# Altium schematic sheet analog.SchDoc
size A4; DocumentNumber: 4; SheetNumber: 2
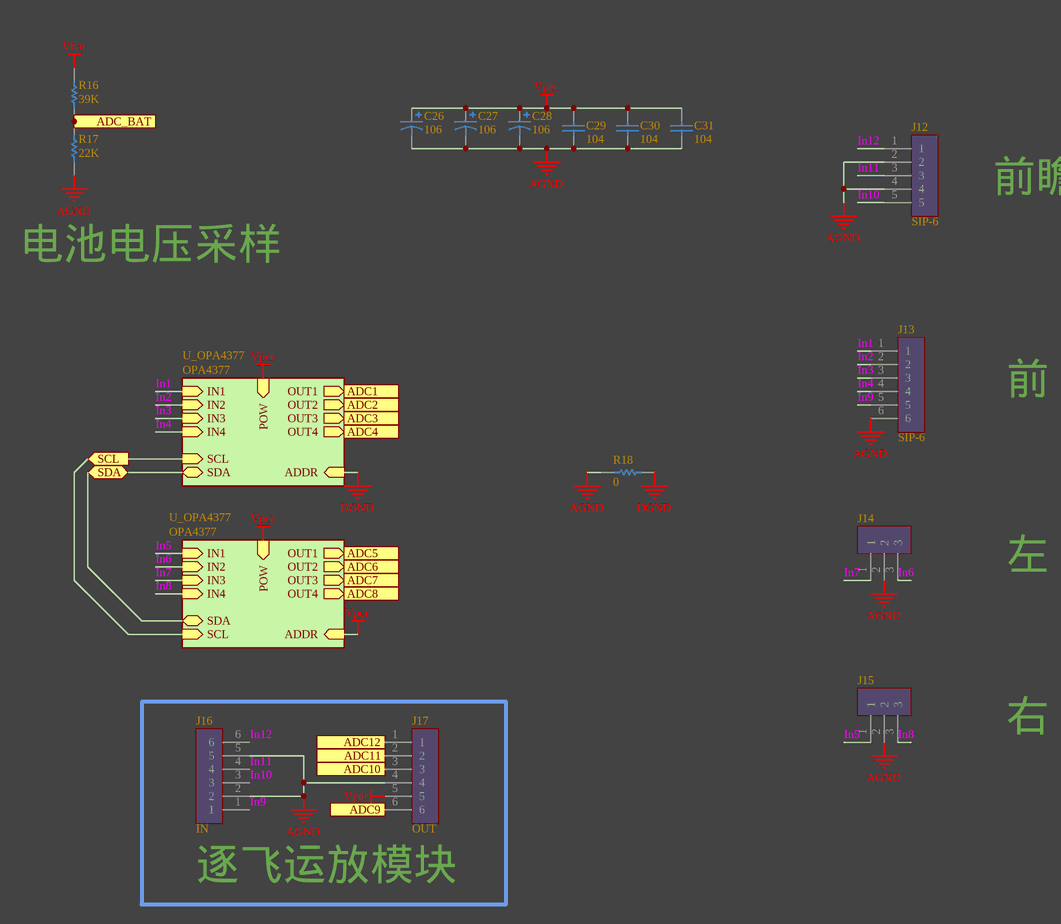
[diagram p0: analog.SchDoc]

## Parts
C26  106  [3216-ce]
C27  106  [3216-ce]
C28  106  [3216-ce]
C29  104  [C0402]
C30  104  [C0402]
C31  104  [C0402]
J12  SIP-6  [2.54排针1X5]
J13  SIP-6  [2.54简易牛角座6P]
J14  SIP-3  [XH2.54-3SMD]  (value not drawn)
J15  SIP-3  [XH2.54-3SMD]  (value not drawn)
J16  IN  [2.54排针1X6]
J17  OUT  [2.54排针1X6]
R16  39K  [R0402]
R17  22K  [R0402]
R18  0  [R0603]

## Blocks framed on the sheet
逐飞运放模块: J16 J17

## Sub-sheets
U_OPA4377 = OPA4377: IN1 (in), IN2 (in), IN3 (in), IN4 (in), OUT1 (out), OUT2 (out), OUT3 (out), OUT4 (out), POW (in), ADDR (in), SDA (bidir), SCL (in)
U_OPA4377 = OPA4377: IN1 (in), IN2 (in), IN3 (in), IN4 (in), OUT1 (out), OUT2 (out), OUT3 (out), OUT4 (out), POW (in), ADDR (in), SDA (bidir), SCL (in)

## Ports
ADC1 (out), ADC2 (out), ADC3 (out), ADC4 (out), ADC5 (out), ADC6 (out), ADC7 (out), ADC8 (out), ADC9 (out), ADC10 (out), ADC11 (out), ADC12 (out), ADC_BAT (out), SCL (in), SDA (bidir)

## Nets
AGND: C26.2 C27.2 C28.2 C29.1 C30.1 C31.1 J12.2 J12.4 J13.6 J14.2 J15.2 J16.2 J16.5 J17.4 R17.1 R18.2
DGND: R18.1 ; sheet U_OPA4377/ADDR
Vbat: R16.2
Vper: C26.1 C27.1 C28.1 C29.2 C30.2 C31.2 J17.5 ; sheet U_OPA4377/POW, sheet U_OPA4377/POW, sheet U_OPA4377/ADDR
ADC1: port ADC1, sheet U_OPA4377/OUT1
ADC2: port ADC2, sheet U_OPA4377/OUT2
ADC3: port ADC3, sheet U_OPA4377/OUT3
ADC4: port ADC4, sheet U_OPA4377/OUT4
ADC5: port ADC5, sheet U_OPA4377/OUT1
ADC6: port ADC6, sheet U_OPA4377/OUT2
ADC7: port ADC7, sheet U_OPA4377/OUT3
ADC8: port ADC8, sheet U_OPA4377/OUT4
ADC9: J17.6 ; port ADC9
ADC10: J17.3 ; port ADC10
ADC11: J17.2 ; port ADC11
ADC12: J17.1 ; port ADC12
ADC_BAT: R16.1 R17.2 ; port ADC_BAT
In1: J13.1 ; sheet U_OPA4377/IN1
In2: J13.2 ; sheet U_OPA4377/IN2
In3: J13.3 ; sheet U_OPA4377/IN3
In4: J13.4 ; sheet U_OPA4377/IN4
In5: J15.1 ; sheet U_OPA4377/IN1
In6: J14.3 ; sheet U_OPA4377/IN2
In7: J14.1 ; sheet U_OPA4377/IN3
In8: J15.3 ; sheet U_OPA4377/IN4
In9: J13.5 J16.1
In10: J12.5 J16.3
In11: J12.3 J16.4
In12: J12.1 J16.6
SCL: port SCL, sheet U_OPA4377/SCL, sheet U_OPA4377/SCL
SDA: port SDA, sheet U_OPA4377/SDA, sheet U_OPA4377/SDA

## Notes on the sheet
- 前瞻
- 电池电压采样
- 前
- 左
- 右

## Library data of the parts
C26-C28 = 电解电容: Polarized Capacitor (Axial); Value: 100pF; Published: 8-Jun-2000; LatestRevisionDate: 17-Jul-2002; LatestRevisionNote: Re-released for DXP Platform.; PackageReference: POLAR0.8; Publisher: Altium Limited; PackageDescription: Polarized Capacitor; 2 Leads
C29-C31 = 电容: Capacitor; Value: 22pF; Published: 8-Jun-2000; LatestRevisionDate: 17-Jul-2002; LatestRevisionNote: Re-released for DXP Platform.; PackageReference: RAD-0.3; Publisher: Altium Limited; PackageDescription: Radial Cap, Thru-Hole; 2 Leads; 0.3 in Pin Spacing
J12 = SIP-5
J16 J17 = SIP-6
R16-R18 = 电阻: Resistor; Value: 150R; Published: 8-Jun-2000; LatestRevisionDate: 17-Jul-2002; LatestRevisionNote: Re-released for DXP Platform.; PackageReference: AXIAL-0.3; Publisher: Altium Limited; PackageDescription: Axial Device, Thru-Hole; 2 Leads; 0.3 in Pin Spacing